# EAGLE schematic hexapod_mk2_main_v2.0 (EAGLE 9.6.2)
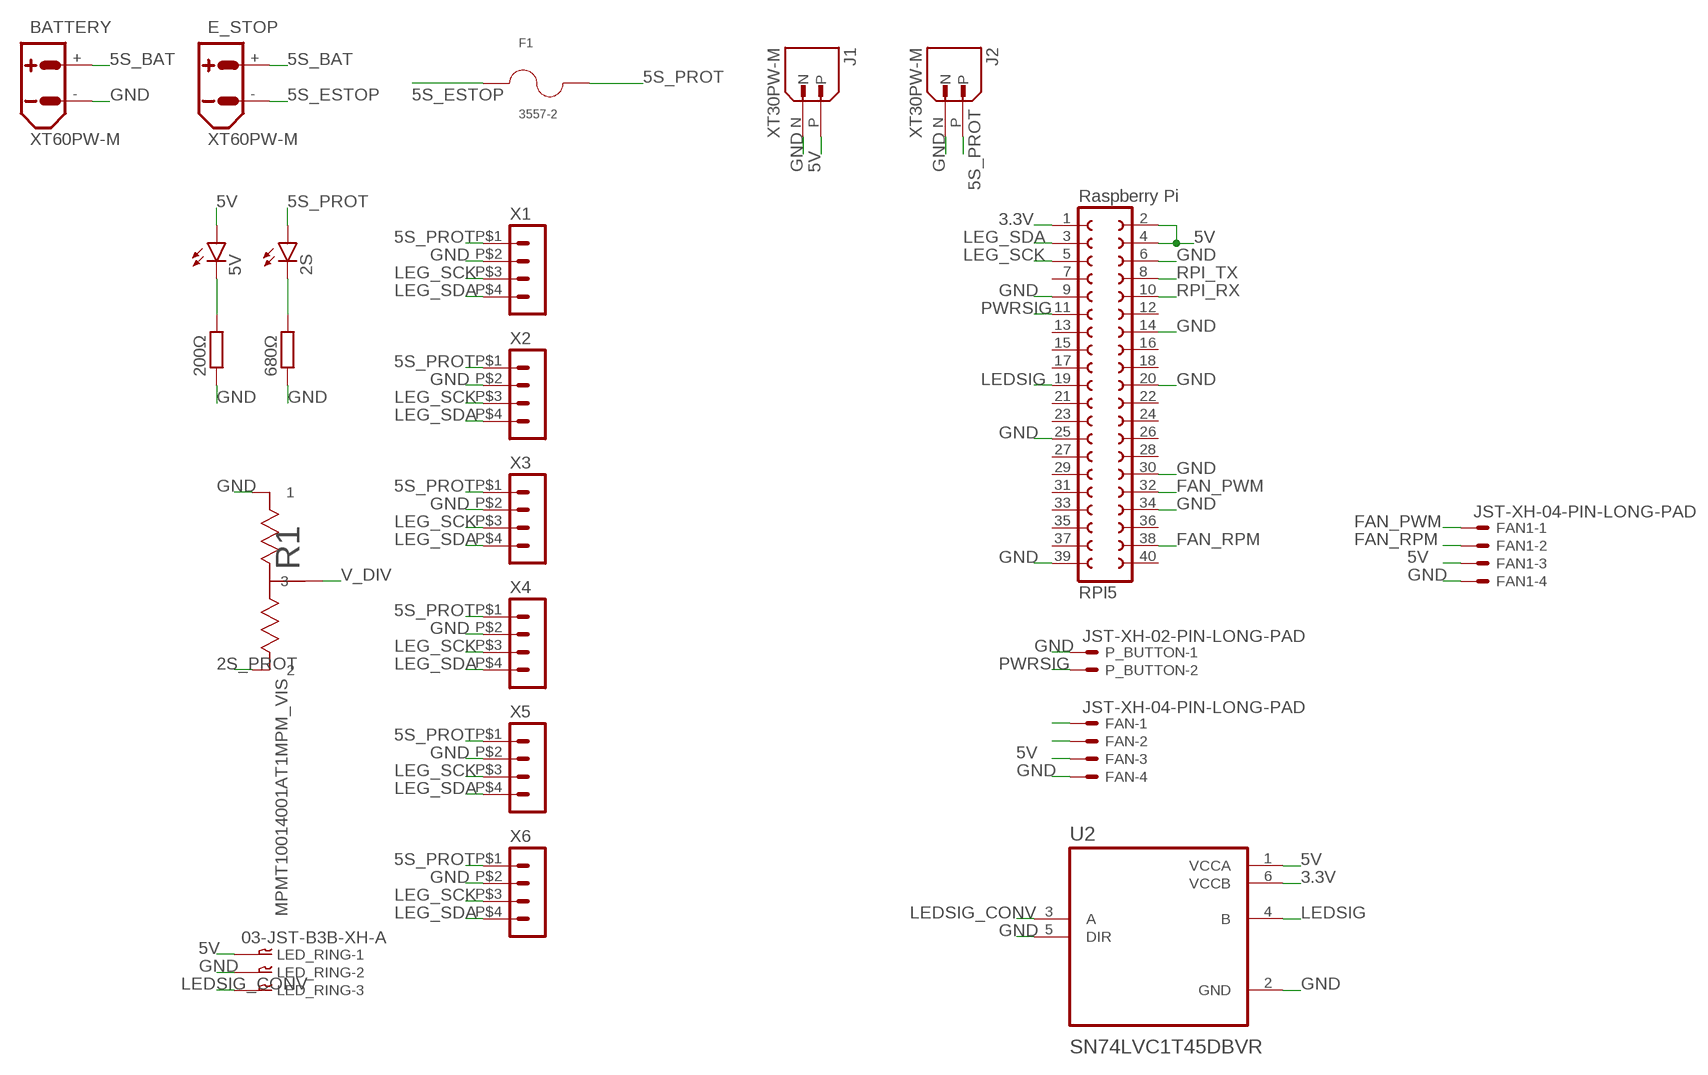
[diagram p0: schematic, sheet 1]

## Parts
2S  LEDCHIPLED_0805  [CHIPLED_0805]
5V  LEDCHIPLED_0805  [CHIPLED_0805]
200Ω  R-EU_R0805  [R0805]
680Ω  R-EU_R0805  [R0805]
BATTERY  XT60PW-M  [XT60PW-M]
E_STOP  XT60PW-M  [XT60PW-M]
F1  3557-2  [FUSE_3557-2]
FAN  JST-XH-04-PIN-LONG-PAD  [JST-XH-04-PACKAGE-LONG-PAD]
FAN1  JST-XH-04-PIN-LONG-PAD  [JST-XH-04-PACKAGE-LONG-PAD]
J1  XT30PW-M  [AMASS_XT30PW-M]
J2  XT30PW-M  [AMASS_XT30PW-M]
LED_RING  03-JST-B3B-XH-A  [B3B-XH]
P_BUTTON  JST-XH-02-PIN-LONG-PAD  [JST-XH-02-PACKAGE-LONG-PAD]
R1  MPMT10014001AT1MPM_VIS  [MPM_VIS]
RPI5  Raspberry Pi  FE20-2  [FE20-2]
U2  SN74LVC1T45DBVR  [SOT95P280X145-6N]
X1  HEADER_POS4_43045-0412  [43045-0412]
X2  HEADER_POS4_43045-0412  [43045-0412]
X3  HEADER_POS4_43045-0412  [43045-0412]
X4  HEADER_POS4_43045-0412  [43045-0412]
X5  HEADER_POS4_43045-0412  [43045-0412]
X6  HEADER_POS4_43045-0412  [43045-0412]

## Nets
2S_PROT: R1.2
3.3V: RPI5.1 U2.6(VCCB)
5S_BAT: BATTERY.+ E_STOP.+
5S_ESTOP: E_STOP.- F1.1_1 F1.1_2
5S_PROT: 2S.A F1.2_1 F1.2_2 J2.P X1.P$1 X2.P$1 X3.P$1 X4.P$1 X5.P$1 X6.P$1
5V: 5V.A FAN1.3 FAN.3 J1.P LED_RING.P$1 RPI5.2 RPI5.4 U2.1(VCCA)
FAN_PWM: FAN1.1 FAN.1 RPI5.32
FAN_RPM: FAN1.2 FAN.2 RPI5.38
GND: 200Ω.1 680Ω.1 BATTERY.- FAN1.4 FAN.4 J1.N J2.N LED_RING.P$2 P_BUTTON.1 R1.1 RPI5.6 RPI5.9 RPI5.14 RPI5.20 RPI5.25 RPI5.30 RPI5.34 RPI5.39 U2.2(GND) U2.5(DIR) X1.P$2 X2.P$2 X3.P$2 X4.P$2 X5.P$2 X6.P$2
LEDSIG: RPI5.19 U2.4(B)
LEDSIG_CONV: LED_RING.P$3 U2.3(A)
LEG_SCK: RPI5.5 X1.P$3 X2.P$3 X3.P$3 X4.P$3 X5.P$3 X6.P$3
LEG_SDA: RPI5.3 X1.P$4 X2.P$4 X3.P$4 X4.P$4 X5.P$4 X6.P$4
N$1: 5V.C 200Ω.2
N$2: 2S.C 680Ω.2
PWRSIG: P_BUTTON.2 RPI5.11
RPI_RX: RPI5.10
RPI_TX: RPI5.8
V_DIV: R1.3
Unconnected: RPI5.7 RPI5.12 RPI5.13 RPI5.15 RPI5.16 RPI5.17 RPI5.18 RPI5.21 RPI5.22 RPI5.23 RPI5.24 RPI5.26 RPI5.27 RPI5.28 RPI5.29 RPI5.31 RPI5.33 RPI5.35 RPI5.36 RPI5.37 RPI5.40

## Library data of the parts
2S 5V = led:LED: LED OSRAM: - CHIPLED LG R971, LG N971, LY N971, LG Q971, LY Q971, LO R971, LY R971 LH N974, LH R974 LS Q976, LO Q976, LY Q976 LO Q996 - Hyper CHIPLED LW Q18S LB Q993, LB Q99A, LB R99A - SideLED LS A670, LO A670, LY A670, LG A670, LP A670 LB A673, LV A673, LT A673, LW A673 LH A674 LY A675 LS A676, LA A676, LO A676, LY A676, LW A676 LS A679, LY A679, LG A679 - Hyper Micro SIDELED® LS Y876, LA Y876, LO Y876, LY Y876 LT Y87S - SmartLED LW L88C, LW L88S LB L89C, LB L89S, LG L890 LS L89K, LO L89K, LY L89K LS L896, LA L896, LO L896, LY L896 - TOPLED LS T670, LO T670, LY T670, LG T670, LP T670 LSG T670, LSP T670, LSY T670, LOP T670, LYG T670 LG T671, LOG T671, LSG T671 LB T673, LV T673, LT T673, LW T673 LH T674 LS T676, LA T676, LO T676, LY T676, LB T676, LH T676, LSB T676, LW T676 LB T67C, LV T67C, LT T67C, LS T67K, LO T67K, LY T67K, LW E67C LS E67B, LA E67B, LO E67B, LY E67B, LB E67C, LV E67C, LT E67C LW T67C LS T679, LY T679, LG T679 LS T770, LO T770, LY T770, LG T770, LP T770 LB T773, LV T773, LT T773, LW T773 LH T774 LS E675, LA E675, LY E675, LS T675 LS T776, LA T776, LO T776, LY T776, LB T776 LHGB T686 LT T68C, LB T68C - Hyper Mini TOPLED® LB M676 - Mini TOPLED Santana® LG M470 LS M47K, LO M47K, LY M47K Source: http://www.osram.convergy.de LUXEON: - LUMILED® LXK2-PW12-R00, LXK2-PW12-S00, LXK2-PW14-U00, LXK2-PW14-V00 LXK2-PM12-R00, LXK2-PM12-S00, LXK2-PM14-U00 LXK2-PE12-Q00, LXK2-PE12-R00, LXK2-PE12-S00, LXK2-PE14-T00, LXK2-PE14-U00 LXK2-PB12-K00, LXK2-PB12-L00, LXK2-PB12-M00, LXK2-PB14-N00, LXK2-PB14-P00, LXK2-PB14-Q00 LXK2-PR12-L00, LXK2-PR12-M00, LXK2-PR14-Q00, LXK2-PR14-R00 LXK2-PD12-Q00, LXK2-PD12-R00, LXK2-PD12-S00 LXK2-PH12-R00, LXK2-PH12-S00 LXK2-PL12-P00, LXK2-PL12-Q00, LXK2-PL12-R00 Source: www.luxeon.com KINGBRIGHT: KA-3528ASYC Source: www.kingbright.com
200Ω 680Ω = rcl:R-EU_: RESISTOR, European symbol; SPICEPREFIX: R
BATTERY E_STOP = amass:XT60: AMASS XT60 connector Store in Japan AMASS XT60 connector <https://szc.jp/ams-xt60>
F1 = 3557-2:3557-2; MANUFACTURER: Keystone; MAXIMUM_PACKAGE_HEIGHT: 7.37mm; PARTREV: D; SNAPEDA_PN: 3557-2; STANDARD: Manufacturer Recommendation
FAN FAN1 = Rembrandt Electronics - JST XH Connectors v1-0:JST-XH-04-PIN: JST XH Connector 2 Pin Wire to board connector. Pitch: 2,54 mm, (0.100") Number of pins: 4 Created by Rembrandt Electronics www.rembrandtelectronics.com
J1 J2 = XT30PW-M:XT30PW-M: Check availability <https://pricing.snapeda.com/parts/XT30PW-M/AMASS/view-part?ref=eda>; AVAILABILITY: Not in stock; CHECK_PRICES: https://www.snapeda.com/parts/XT30PW-M/AMASS/view-part/?ref=eda; DESCRIPTION: Socket; DC supply; XT30; male; PIN: 2; on PCBs; THT; Colour: yellow; MF: AMASS; MP: XT30PW-M; PACKAGE: None; PRICE: None; SNAPEDA_LINK: https://www.snapeda.com/parts/XT30PW-M/AMASS/view-part/?ref=snap
LED_RING = bt_con-jst-xh:03-JST: JST CONNECTOR
P_BUTTON = Rembrandt Electronics - JST XH Connectors v1-0:JST-XH-02-PIN: JST XH Connector 2 Pin Wire to board connector. Pitch: 2,54 mm, (0.100") Number of pins: 2 Created by Rembrandt Electronics www.rembrandtelectronics.com
R1 = MPMT10014001AT1:MPMT10014001AT1; COPYRIGHT: Copyright (C) 2024 Ultra Librarian. All rights reserved.; MANUFACTURER_PART_NUMBER: MPMT10014001AT1; MFR_NAME: Vishay
RPI5 = con-lsta:FE20-2: FEMALE HEADER; OC_FARNELL: unknown; OC_NEWARK: unknown
U2 = SN74LVC1T45DBVR:SN74LVC1T45DBVR
X1-X6 = con-molex-micro-fit-3_0:HEADER_POS4_?: Molex - Micro-Fit 3.0 Series connector, 3.00mm (0.118") pitch header, 4 positions.

## Module RASPBERRYPI_PINOUT
Ports: 

### Library data of the parts

## Net classes
0 default: clearance 0.205 mm